# EAGLE schematic emonDCmini v0.7a (EAGLE 8.3.2)
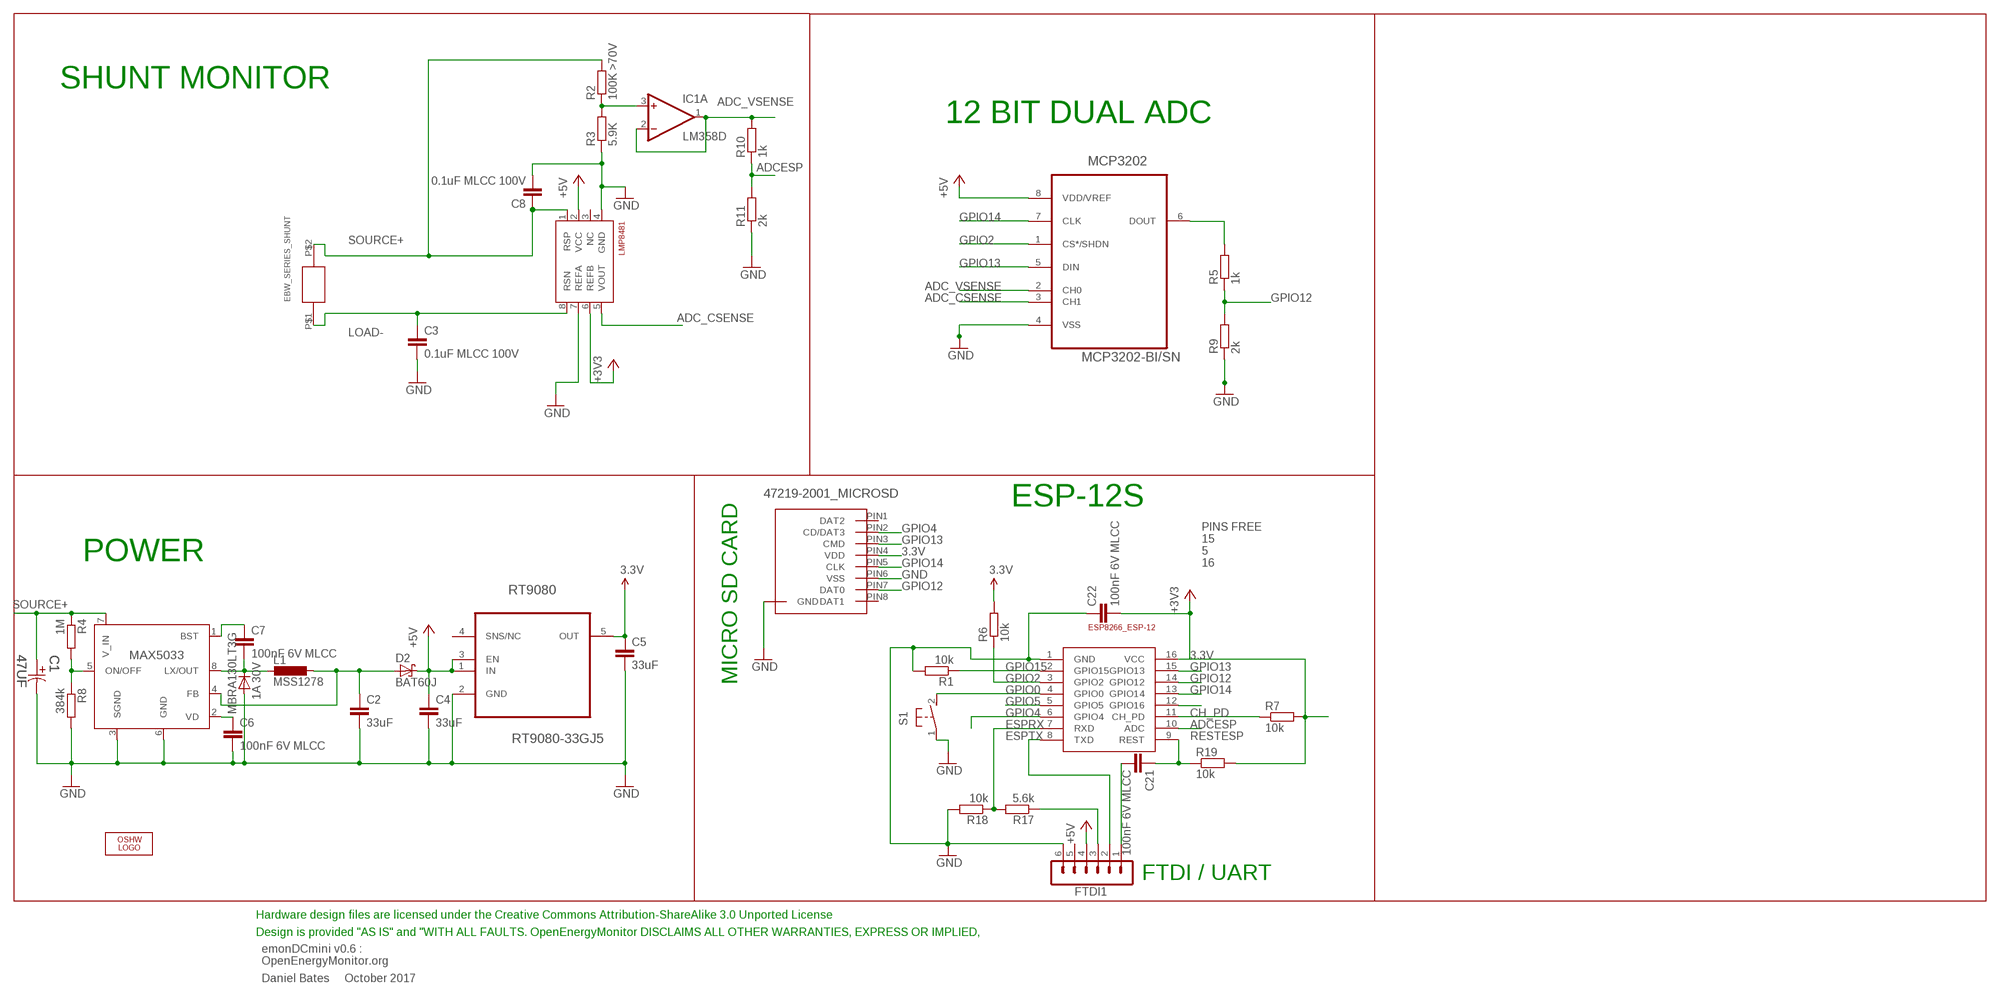
[diagram p0: schematic, sheet 1]

## Parts
C1  47UF  EEV-FK2A470Q-CASE-H13  [CAPAE1350X1400N]
C2  33uF  C-EUC1210  [C1210]
C3  0.1uF MLCC 100V  C-EUC0603  [C0603]
C4  33uF  C-EUC1210  [C1210]
C5  33uF  C-EUC1210  [C1210]
C6  100nF 6V MLCC  C-EUC0603  [C0603]
C7  100nF 6V MLCC  C-EUC0603  [C0603]
C8  0.1uF MLCC 100V  C-EUC0603  [C0603]
C21  100nF 6V MLCC  C-EUC0603  [C0603]
C22  100nF 6V MLCC  C-EUC0603  [C0603]
D1  MBRA130LT3G  [DO-214]
D2  BAT60J  [SOD323_ST]
EBW_SERIES_SHUNT  EBW_SERIES_15.2MM  [EBW_SERIES_15.2MM]
ESP-12  ESP8266_ESP-12  [ESP8266-ESP12]
FTDI1  FTDI-ESP  MA06-1  [MA06-1]
IC1  LM358D  [SO08]
L1  MSS1278  [MSS1278]
LMP8481  LMP8481-H  LMP8481LMP8481-H  [S-PDSO-G08]
LOGO1  OSHW_LOGO_6MILX0200-NT  [OSHW_6X200_NOTEXT]
MAX5033  MAX5033BUSA+  [21-0111D_SBE-14]
MCP3202  MCP3202-BI/SN  [SOIC127P600X175-8N]
R1  10k  R-EU_R0603  [R0603]
R2  100K >70V  R-EU_R0603  [R0603]
R3  5.9K  R-EU_R0603  [R0603]
R4  1M  R-EU_R0603  [R0603]
R5  1k  R-EU_R0603  [R0603]
R6  10k  R-EU_R0603  [R0603]
R7  10k  R-EU_R0603  [R0603]
R8  384k  R-EU_R0603  [R0603]
R9  2k  R-EU_R0603  [R0603]
R10  1k  R-EU_R0603  [R0603]
R11  2k  R-EU_R0603  [R0603]
R17  5.6k  R-EU_R0603  [R0603]
R18  10k  R-EU_R0603  [R0603]
R19  10k  R-EU_R0603  [R0603]
RT9080  RT9080-33GJ5  [TSOT-23-5]
S1  DTSM-3  [DTSM-3]
U$2  47219-2001_MICROSD  [47219-2001_MICROSD]

## Nets
3.3V: C5.1 C22.2 ESP-12.16(VCC) LMP8481.6(REFB) R6.2 R7.2 R19.2 RT9080.5(OUT) U$2.PIN4(VDD) ; supply symbol labelled +3V3
+5V: C4.1 D2.C FTDI1.4 MCP3202.8(VDD/VREF) RT9080.1(IN) RT9080.3(EN)
ADC_CSENSE: LMP8481.5(VOUT) MCP3202.3(CH1)
ADC_VSENSE: IC1.1(A:OUT) IC1.2(A:-IN) MCP3202.2(CH0) R10.2
ADC_VSENSE_INT: IC1.3(A:+IN) R2.1 R3.2
ADCESP: ESP-12.10(ADC) R10.1 R11.2
CH_PD: ESP-12.11(CH_PD) R7.1
ESPRX: ESP-12.7(RXD) R17.2 R18.1
ESPTX: ESP-12.8(TXD) FTDI1.2
GND [thin_power]: C1.2 C2.2 C3.2 C4.2 C5.2 C6.2 C8.2 C22.1 D1.P$2(A) ESP-12.1(GND) FTDI1.6 LMP8481.4(GND) LMP8481.7(REFA) MAX5033.3(SGND) MAX5033.6(GND) MCP3202.4(VSS) R1.2 R3.1 R8.2 R9.1 R11.1 R18.2 RT9080.2(GND) S1.1 U$2.P$1(GND) U$2.P$2(GND) U$2.P$3(GND) U$2.P$4(GND) U$2.PIN6(VSS)
GPIO0: ESP-12.4(GPIO0) S1.2
GPIO2: ESP-12.3(GPIO2) MCP3202.1(CS*/SHDN) R6.1
GPIO4: ESP-12.6(GPIO4) U$2.PIN2(CD/DAT3)
GPIO5: ESP-12.5(GPIO5)
GPIO12: ESP-12.14(GPIO12) R5.1 R9.2 U$2.PIN7(DAT0)
GPIO12A: MCP3202.6(DOUT) R5.2
GPIO13: ESP-12.15(GPIO13) MCP3202.5(DIN) U$2.PIN3(CMD)
GPIO14: ESP-12.13(GPIO14) MCP3202.7(CLK) U$2.PIN5(CLK)
GPIO15: ESP-12.2(GPIO15) R1.1
LOAD- [power]: C3.1 EBW_SERIES_SHUNT.P$1 LMP8481.8(RSN)
N$1: ESP-12.12(GPIO16)
N$2: MAX5033.5(ON/OFF) R4.2 R8.1
N$3: C7.2 D1.P$1(C) L1.P$2 MAX5033.8(LX/OUT)
N$4: C6.1 MAX5033.2(VD)
N$5: C7.1 MAX5033.1(BST)
N$7: C2.1 D2.A L1.P$1 MAX5033.4(FB)
N$36: FTDI1.3 R17.1
RESTESP: C21.1 ESP-12.9(REST) R19.1
RST: C21.2 FTDI1.1
SOURCE+ [power]: C1.1 C8.1 EBW_SERIES_SHUNT.P$2 LMP8481.1(RSP) R2.2 R4.1
Unconnected: FTDI1.5 IC1.5(B:+IN) IC1.6(B:-IN) IC1.7(B:OUT) LMP8481.2(VCC) LMP8481.3(NC) RT9080.4(SNS/NC) U$2.PIN1(DAT2) U$2.PIN8(DAT1)

## Notes on the sheet
- SHUNT MONITOR
- 12 BIT DUAL ADC
- ESP-12S
- POWER
- PINS FREE
  15
  5
  16
- MICRO SD CARD
- FTDI / UART
- Hardware design files are licensed under the Creative Commons Attribution-ShareAlike 3.0 Unported License
- Design is provided "AS IS" and "WITH ALL FAULTS. OpenEnergyMonitor DISCLAIMS ALL OTHER WARRANTIES, EXPRESS OR IMPLIED,
- emonDCmini v0.6 :
  OpenEnergyMonitor.org
- Daniel Bates     October 2017

## Power pins joined to a net without a drawn wire
V+: IC1.8(P:V+)
V-: IC1.4(P:V-)
V_IN: MAX5033.7(V_IN)

## Library data of the parts
C1 = Panasonic-EEE-EEV-EEF-ECQ:EEV-: Aluminum Electrolytic Capacitors,Surface Mount Type; MPN: EEVFK2A470Q; OC_FARNELL: 9696148; OC_NEWARK: 96K9488; SUPPLIER: PANASONIC; TOLERANCE: ±20 %; VOLTAGERATING: 100V
C2 C4 C5 = rcl:C-EU: CAPACITOR, European symbol; MPN: TCQB336M006R0070
C3 C6-C8 C21 C22 = rcl:C-EU: CAPACITOR, European symbol
D1 = CASE 403D Diode:MBRA130LT3G: Fast switching diode; MF: ON SEMICONDUCTOR; MPN: MBRA130LT3G; OC_FARNELL: 9555978
D2 = diode:BAT60J: Schottky barrier diode Source: www.st.com, BAT60J.pdf
EBW_SERIES_SHUNT = EBW series shunt:EBW_SERIES_15.2MM
ESP-12 = ESP8266-ESP12:ESP8266_ESP-12
FTDI1 = JeeLabs:MA06-1: PIN HEADER
IC1 = linear:LM358: OP AMP also LM158; LM258; LM2904 Source: http://cache.national.com/ds/LM/LM158.pdf
L1 = MSS1278:MSS1278; MPN: MSS1278-224KLD
LMP8481 = lmp8481b:LMP8481: LMP8481MM-H/NOPB 100V/V
LOGO1 = ohw-logo:OSHW_LOGO_6MIL; OC_FARNELL: unknown
MAX5033 = MAX5033:MAX5033BUSA+: SWITCHING REGULATOR 5.0V; MANUFACTURER_PART_NUMBER: MAX5033BUSA+; VENDOR: MAXIM
MCP3202 = Microchip-MCP3202-BI_SN:MCP3202-BI/SN: IC ADC 12BIT 2.7V 2CH SPI,SOIC-8; MPN: MCP3202-BI/SN; OC_FARNELL: 1196803; OC_NEWARK: 96K3721; PACKAGE: SOIC-8; SUPPLIER: Microchip
R1 R4 R6-R8 R17-R19 = rcl:R-EU_: RESISTOR, European symbol
R2 = rcl:R-EU_: RESISTOR, European symbol; MPN: MCWR06X1003FTL
R3 R5 R9-R11 = rcl:R-EU_: RESISTOR, European symbol; MPN: MCWR06X5901FTL
RT9080 = TSOT-23-5 REGULATOR 3.3v:RT9080-33GJ5: Low-Dropout Regulator; OC_FARNELL: 2679852; PACKAGE: SOT-23-5
S1 = switch-tact:DTSM-3
U$2 = MOLEX 47219-2001:47219-2001_MICROSD

## Net classes
1 power: width 1.016 mm
2 thin_power: width 0.254 mm